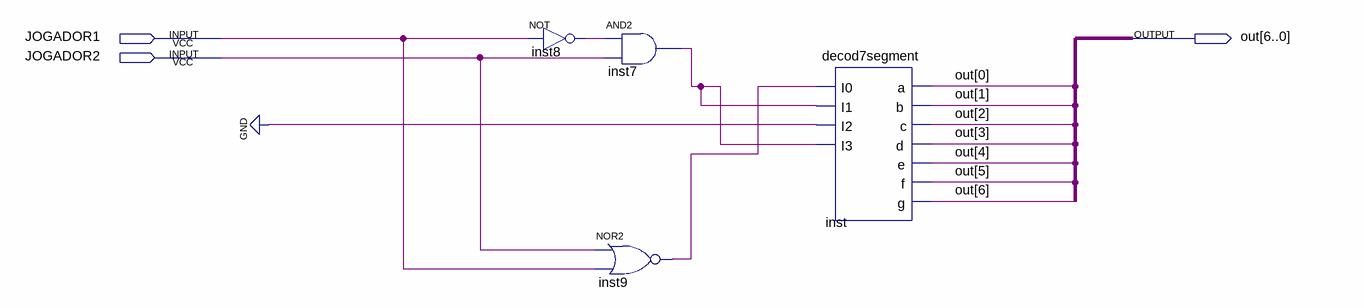
[diagram p0: schematic sheet]
// Quartus schematic visor.bdf as structural Verilog: 4 symbols, 3 pins
module visor (
  input  JOGADOR1,
  input  JOGADOR2,
  output [6:0] out
);

  wire inst7_out, inst8_out, inst9_out;

  not inst8 (inst8_out, JOGADOR1);
  and inst7 (inst7_out, inst8_out, JOGADOR2);
  nor inst9 (inst9_out, JOGADOR2, JOGADOR1);
  decod7segment inst (
    .I0(inst9_out), .I1(inst7_out), .I2(1'b0), .I3(inst7_out), .a(out[0]), .b(out[1]), .c(out[2]),
    .d(out[3]), .e(out[4]), .f(out[5]), .g(out[6]));
endmodule
